# EAGLE design arduino board rev 1.4 (EAGLE 9.4.2)
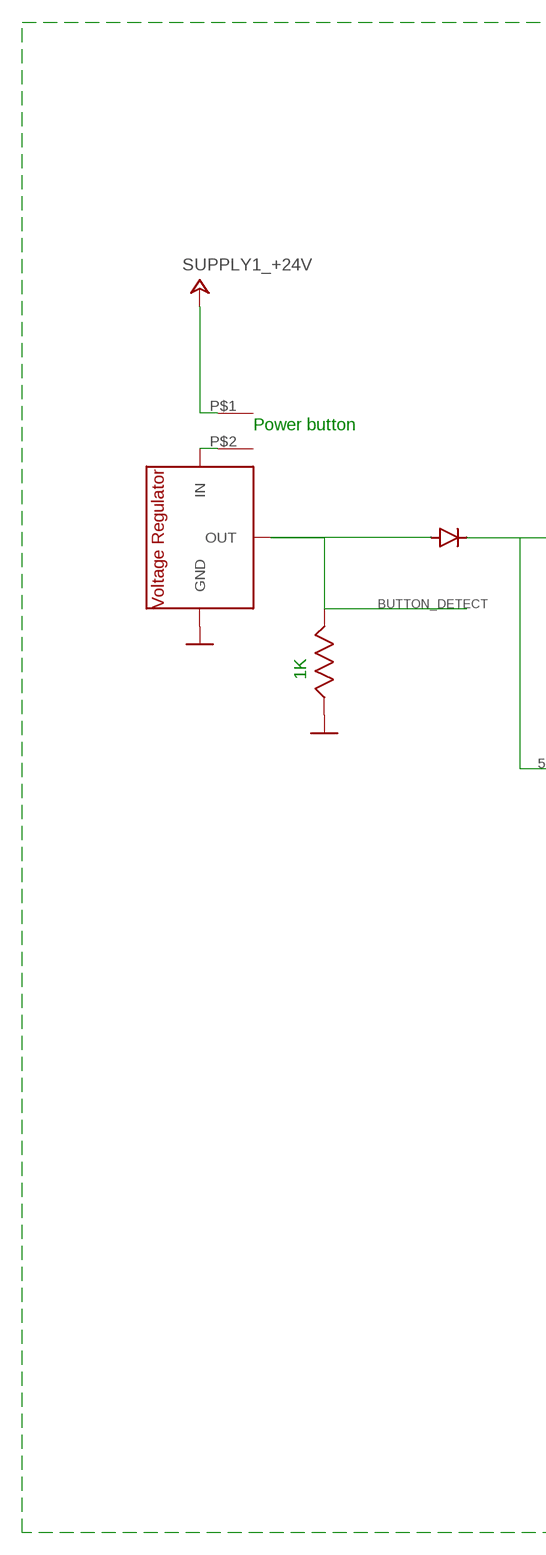
[diagram p0: schematic, sheet 1, part 1 of 2]
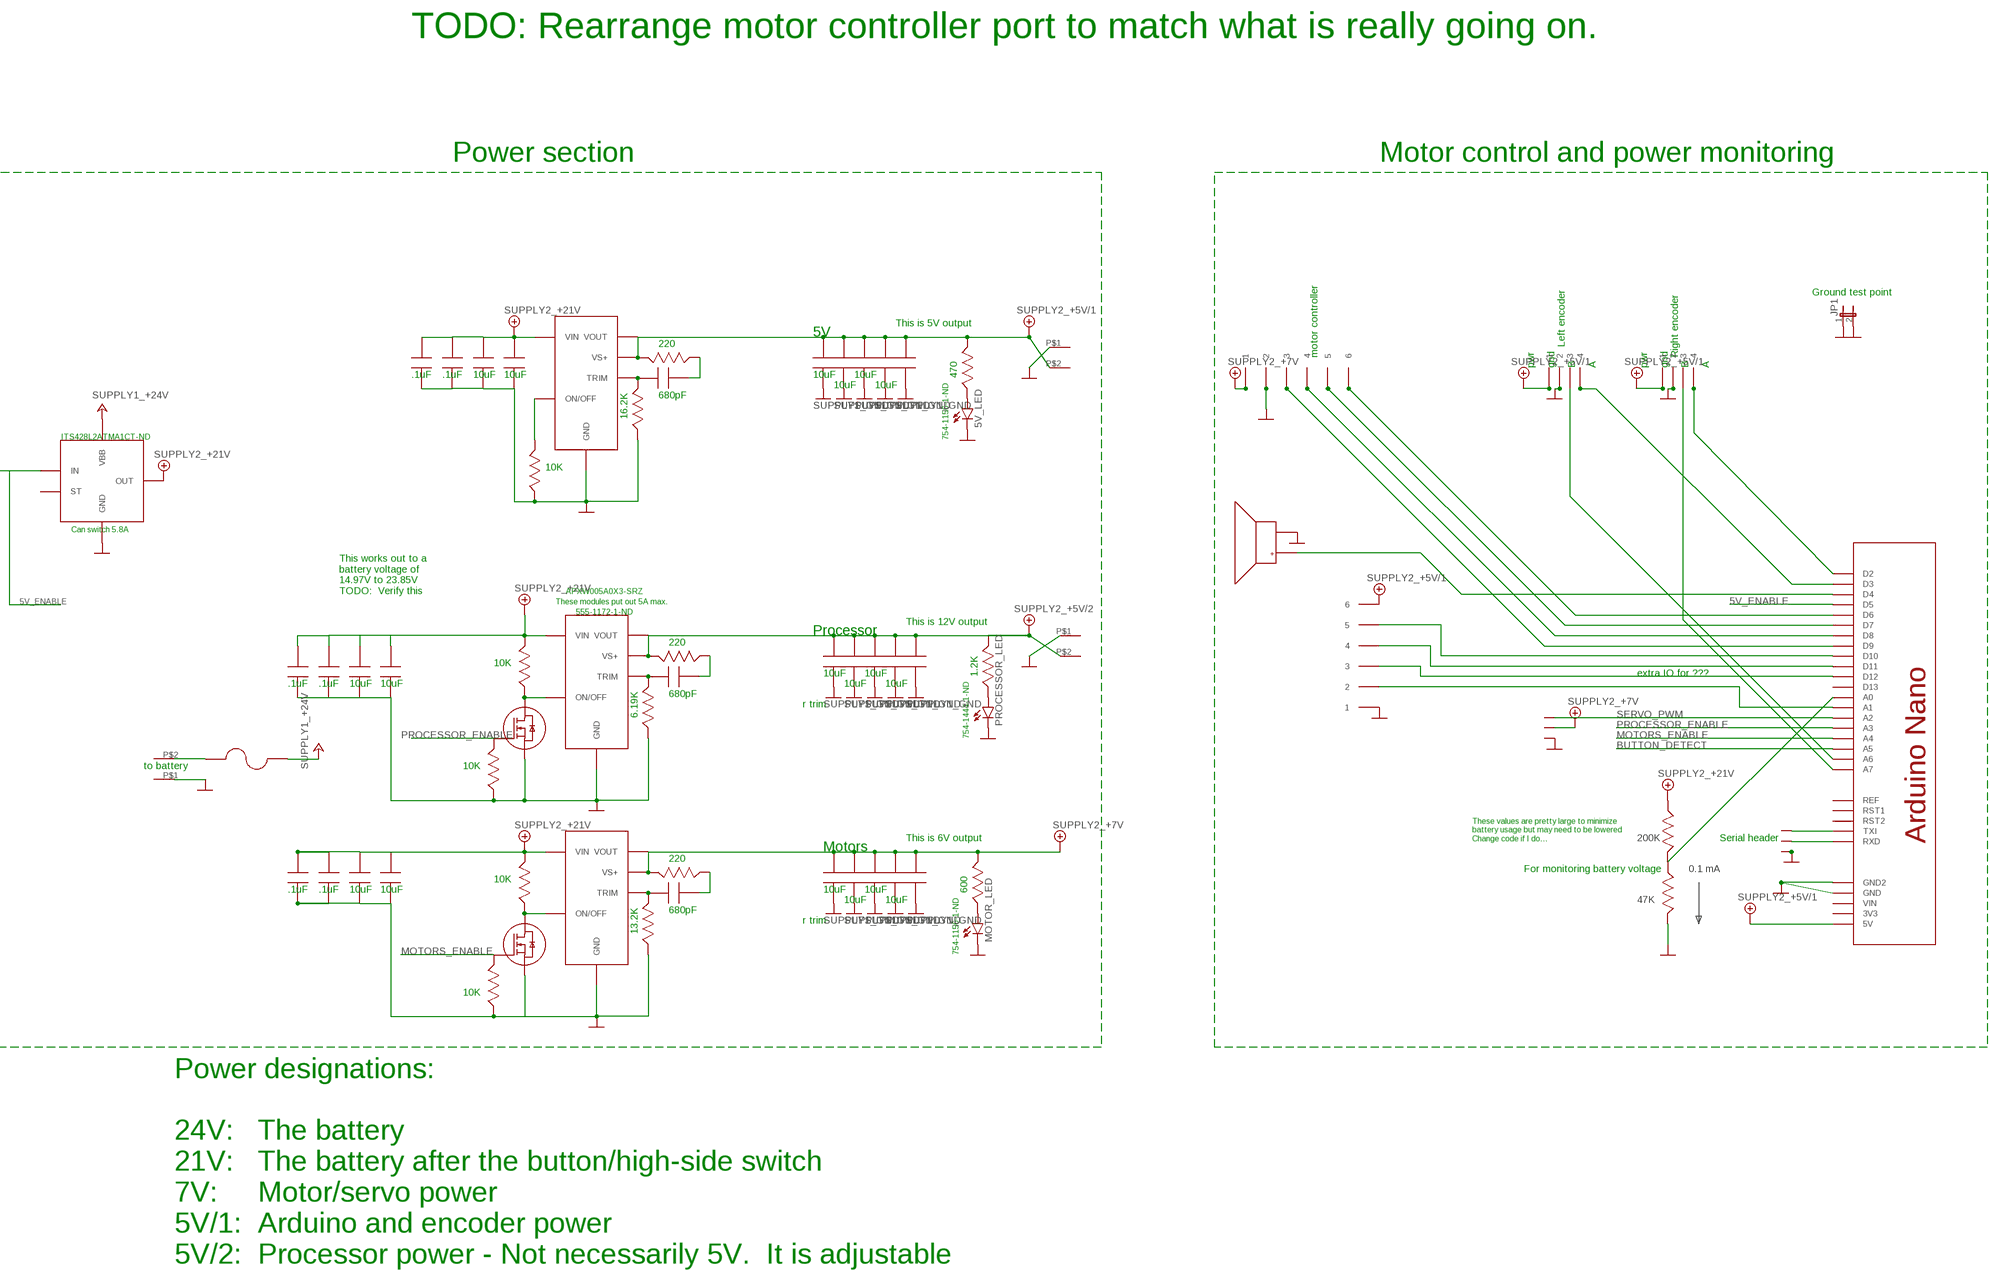
[diagram p1: schematic, sheet 1, part 2 of 2]

## Parts
5V_C_680PF  JACK_CAPACITOR0805  [JACK_0805]
5V_IN_CAP_1  JACK_CAPACITOR  [JACK_1210]
5V_IN_CAP_2  JACK_CAPACITOR  [JACK_1210]
5V_IN_CAP_3  JACK_CAPACITOR  [JACK_1210]
5V_IN_CAP_4  JACK_CAPACITOR  [JACK_1210]
5V_LED  LED_LEDSML1206  [LED_SML1206]
5V_LED_R1  JACK_RESISTOR0805  [JACK_0805]
5V_OUT_CAP_1  JACK_CAPACITOR  [JACK_1210]
5V_OUT_CAP_2  JACK_CAPACITOR  [JACK_1210]
5V_OUT_CAP_3  JACK_CAPACITOR  [JACK_1210]
5V_OUT_CAP_4  JACK_CAPACITOR  [JACK_1210]
5V_OUT_CAP_5  JACK_CAPACITOR  [JACK_1210]
5V_R_220  JACK_RESISTOR0805  [JACK_0805]
5V_REGULATOR_PULLDOWN  JACK_RESISTOR0805  [JACK_0805]
BATTERY_VOLTAGE_DIVIDER_HIGH  JACK_RESISTOR0805  [JACK_0805]
BATTERY_VOLTAGE_DIVIDER_LOW  JACK_RESISTOR0805  [JACK_0805]
BEEPER  JACK_BEEPER  [JACK_BEEPER_433-1033-ND]
DC2DC_PROCESSOR_  JACK_DC_TO_DC_VARIABLE_555-1172-1-ND  [JACK_DC2DC_555-1172-1-ND]
HIGH-SIDE_BLOCKING_DIODE  JACK_DIODESOD-23/SC-76  [JACK_SOD-323/SC-76]
HIGH-SIDE_SWITCH  JACK_HIGH-SIDE_SWITCH_INFINEON_ITS428L2  [JACK_INFINEON_TO-252-5-11]
HIGH-SIDE_SWITCH_BUTTON_DIVIDER_LOW  JACK_RESISTOR0805  [JACK_0805]
JP1  JUMPER_JP1E  [JUMPER_JP1]
MOTOR.1UF  JACK_CAPACITOR  [JACK_1210]
MOTOR_C_680PF  JACK_CAPACITOR0805  [JACK_0805]
MOTOR_ENABLE_MOSFET  JACK_MOSFET_N_CHANNELBSS138LCT-ND  [JACK_SOT23]
MOTOR_IN10UF  JACK_CAPACITOR  [JACK_1210]
MOTOR_IN.1UF  JACK_CAPACITOR  [JACK_1210]
MOTOR_IN.1UF1  JACK_CAPACITOR  [JACK_1210]
MOTOR_IN.1UF4  JACK_CAPACITOR  [JACK_1210]
MOTOR_LED  LED_LEDSML1206  [LED_SML1206]
MOTOR_LED_R  JACK_RESISTOR0805  [JACK_0805]
MOTOR_MOSFET_PULLDOWN  JACK_RESISTOR0805  [JACK_0805]
MOTOR_PULLUP  JACK_RESISTOR0805  [JACK_0805]
MOTOR_R_220  JACK_RESISTOR0805  [JACK_0805]
MOTOR_TRIM  JACK_RESISTOR0805  [JACK_0805]
MOTOTR10UF  JACK_CAPACITOR  [JACK_1210]
MOTOTR10UF1  JACK_CAPACITOR  [JACK_1210]
MOTOTR10UF2  JACK_CAPACITOR  [JACK_1210]
MOTOTR10UF3  JACK_CAPACITOR  [JACK_1210]
PROC10UF  JACK_CAPACITOR  [JACK_1210]
PROC10UF1  JACK_CAPACITOR  [JACK_1210]
PROC10UF2  JACK_CAPACITOR  [JACK_1210]
PROC10UF3  JACK_CAPACITOR  [JACK_1210]
PROC.1UF  JACK_CAPACITOR  [JACK_1210]
PROC_IN10UF  JACK_CAPACITOR  [JACK_1210]
PROC_IN_.1UF  JACK_CAPACITOR  [JACK_1210]
PROC_IN_.1UF1  JACK_CAPACITOR  [JACK_1210]
PROC_IN_.1UF2  JACK_CAPACITOR  [JACK_1210]
PROCESSOR_C_680PF  JACK_CAPACITOR0805  [JACK_0805]
PROCESSOR_ENABLE_MOSFET  JACK_MOSFET_N_CHANNELBSS138LCT-ND  [JACK_SOT23]
PROCESSOR_LED  LED_LEDSML1206  [LED_SML1206]
PROCESSOR_LED_R  JACK_RESISTOR0805  [JACK_0805]
PROCESSOR_MOSFET_PULLDOWN  JACK_RESISTOR0805  [JACK_0805]
PROCESSOR_PULLUP  JACK_RESISTOR0805  [JACK_0805]
PROCESSOR_R_220  JACK_RESISTOR0805  [JACK_0805]
RTRIM_5V  JACK_RESISTOR0805  [JACK_0805]
RTRIM_PROCESSOR  JACK_RESISTOR0805  [JACK_0805]
SERVO_HEADER  JACK_CONNECTOR_3_PIN  [JACK_THREE_.1"_HOLES]
U$1  JACK_SCREW_TERMINAL_2_CONDUCTORAMP-282837-2  [JACK_AMP-282837-2]
U$2  JACK_SCREW_TERMINAL_2_CONDUCTORAMP-282837-2  [JACK_AMP-282837-2]
U$3  JACK_CONNECTOR_6_PINJST_MAYBE  [JACK_JST_6_PIN_.1"]
U$4  JACK_DC_TO_DC_VARIABLE_555-1172-1-ND  [JACK_DC2DC_555-1172-1-ND]
U$5  JACK_SCREW_TERMINAL_2_CONDUCTORAMP-282837-2  [JACK_AMP-282837-2]
U$6  JACK_SCREW_TERMINAL_2_CONDUCTORAMP-282837-2  [JACK_AMP-282837-2]
U$7  VOLTAGE_REGULATOR  [JACK_SOT23]
U$9  JACK_CONNECTOR_6_PINJST_MAYBE  [JACK_JST_6_PIN_.1"]
U$10  JACK_CONNECTOR_4_PIN  [JACK_JST_4_PIN_.1"]
U$11  JACK_FUSE_HOLDER_F065-ND  [JACK_FUSE_HOLDER_F064-ND]
U$12  JACK_CONNECTOR_4_PIN  [JACK_JST_4_PIN_.1"]
U$13  JACK_CONNECTOR_3_PINMAYBE_JST  [JACK_JST_3_PIN_.1"]
U$14  JACK_ARDUINO_NANO  [JACK_ARDUINO_NANO]
U$17  JACK_DC_TO_DC_VARIABLE_555-1172-1-ND  [JACK_DC2DC_555-1172-1-ND]

## Nets
5V_ENABLE: HIGH-SIDE_BLOCKING_DIODE.C HIGH-SIDE_SWITCH.2(IN) U$14.P$8(D5)
+5V/1: 5V_LED_R1.P$3 5V_OUT_CAP_1.2 5V_OUT_CAP_2.2 5V_OUT_CAP_3.2 5V_OUT_CAP_4.2 5V_OUT_CAP_5.2 5V_R_220.P$3 U$2.P$2 U$3.6 U$4.VOUT U$4.VS+ U$10.1 U$12.1 U$14.P$19(5V) ; supply symbol labelled SUPPLY2_+5V/1
+5V/2: DC2DC_PROCESSOR_.VOUT DC2DC_PROCESSOR_.VS+ PROC10UF1.2 PROC10UF2.2 PROC10UF3.2 PROC10UF.2 PROC.1UF.2 PROCESSOR_LED_R.P$3 PROCESSOR_R_220.P$3 U$5.P$2 ; supply symbol labelled SUPPLY2_+5V/2
+7V: MOTOR.1UF.2 MOTOR_LED_R.P$3 MOTOR_R_220.P$3 MOTOTR10UF1.2 MOTOTR10UF2.2 MOTOTR10UF3.2 MOTOTR10UF.2 SERVO_HEADER.2 U$9.1 U$17.VOUT U$17.VS+ ; supply symbol labelled SUPPLY2_+7V
+21V: 5V_IN_CAP_1.2 5V_IN_CAP_2.2 5V_IN_CAP_3.2 5V_IN_CAP_4.2 BATTERY_VOLTAGE_DIVIDER_HIGH.P$2 DC2DC_PROCESSOR_.VIN HIGH-SIDE_SWITCH.5(OUT) MOTOR_IN10UF.2 MOTOR_IN.1UF1.2 MOTOR_IN.1UF4.2 MOTOR_IN.1UF.2 MOTOR_PULLUP.P$3 PROC_IN10UF.2 PROC_IN_.1UF1.2 PROC_IN_.1UF2.2 PROC_IN_.1UF.2 PROCESSOR_PULLUP.P$3 U$4.VIN U$17.VIN ; supply symbol labelled SUPPLY2_+21V
+24V: HIGH-SIDE_SWITCH.TAB(VBB) U$1.P$1 U$11.P$1 ; supply symbol labelled SUPPLY1_+24V
BUTTON_DETECT: HIGH-SIDE_BLOCKING_DIODE.A HIGH-SIDE_SWITCH_BUTTON_DIVIDER_LOW.P$3 U$7.1(OUT) U$14.P$22(A5)
GND: 5V_IN_CAP_1.1 5V_IN_CAP_2.1 5V_IN_CAP_3.1 5V_IN_CAP_4.1 5V_LED.C 5V_OUT_CAP_1.1 5V_OUT_CAP_2.1 5V_OUT_CAP_3.1 5V_OUT_CAP_4.1 5V_OUT_CAP_5.1 5V_REGULATOR_PULLDOWN.P$2 BATTERY_VOLTAGE_DIVIDER_LOW.P$3 BEEPER.- DC2DC_PROCESSOR_.GND HIGH-SIDE_SWITCH.1(GND) HIGH-SIDE_SWITCH_BUTTON_DIVIDER_LOW.P$2 JP1.1 JP1.2 MOTOR.1UF.1 MOTOR_ENABLE_MOSFET.2(S) MOTOR_IN10UF.1 MOTOR_IN.1UF1.1 MOTOR_IN.1UF4.1 MOTOR_IN.1UF.1 MOTOR_LED.C MOTOR_MOSFET_PULLDOWN.P$2 MOTOR_TRIM.P$2 MOTOTR10UF1.1 MOTOTR10UF2.1 MOTOTR10UF3.1 MOTOTR10UF.1 PROC10UF1.1 PROC10UF2.1 PROC10UF3.1 PROC10UF.1 PROC.1UF.1 PROC_IN10UF.1 PROC_IN_.1UF1.1 PROC_IN_.1UF2.1 PROC_IN_.1UF.1 PROCESSOR_ENABLE_MOSFET.2(S) PROCESSOR_LED.C PROCESSOR_MOSFET_PULLDOWN.P$2 RTRIM_5V.P$2 RTRIM_PROCESSOR.P$2 SERVO_HEADER.1 U$2.P$1 U$3.1 U$4.GND U$5.P$1 U$6.P$1 U$7.3(GND) U$9.2 U$10.2 U$12.2 U$13.1 U$14.P$12(GND) U$14.P$17(GND2) U$17.GND ; supply symbol labelled SUPPLY1_GND
IN: U$1.P$2 U$7.2(IN)
MOTORS_ENABLE: MOTOR_ENABLE_MOSFET.1(G) MOTOR_MOSFET_PULLDOWN.P$3 U$14.P$23(A4)
N$4: PROCESSOR_LED.A PROCESSOR_LED_R.P$2
N$5: MOTOR_LED.A MOTOR_LED_R.P$2
N$6: DC2DC_PROCESSOR_.ON/OFF PROCESSOR_ENABLE_MOSFET.3(D) PROCESSOR_PULLUP.P$2
N$7: U$12.3 U$14.P$20(A7)
N$8: U$3.5 U$14.P$3(D10)
N$9: MOTOR_ENABLE_MOSFET.3(D) MOTOR_PULLUP.P$2 U$17.ON/OFF
N$10: U$9.6 U$14.P$7(D6)
N$11: U$12.4 U$14.P$11(D2)
N$12: U$6.P$2 U$11.P$2
N$13: U$13.3 U$14.P$15(TXI)
N$14: U$13.2 U$14.P$14(RXD)
N$15: U$10.4 U$14.P$10(D3)
N$16: U$10.3 U$14.P$21(A6)
N$17: BEEPER.+ U$14.P$9(D4)
N$18: U$9.5 U$14.P$6(D7)
N$19: U$9.4 U$14.P$5(D8)
N$20: U$9.3 U$14.P$4(D9)
N$21: 5V_C_680PF.P$3 RTRIM_5V.P$3 U$4.TRIM
N$27: U$3.2 U$14.P$26(A1)
N$28: U$3.4 U$14.P$2(D11)
N$29: 5V_LED.A 5V_LED_R1.P$2
N$30: BATTERY_VOLTAGE_DIVIDER_HIGH.P$3 BATTERY_VOLTAGE_DIVIDER_LOW.P$2 U$14.P$27(A0)
N$31: U$3.3 U$14.P$1(D12)
N$32: 5V_REGULATOR_PULLDOWN.P$3 U$4.ON/OFF
N$33: 5V_C_680PF.P$2 5V_R_220.P$2
N$34: DC2DC_PROCESSOR_.TRIM PROCESSOR_C_680PF.P$3 RTRIM_PROCESSOR.P$3
N$35: MOTOR_C_680PF.P$3 MOTOR_TRIM.P$3 U$17.TRIM
N$36: PROCESSOR_C_680PF.P$2 PROCESSOR_R_220.P$2
N$37: MOTOR_C_680PF.P$2 MOTOR_R_220.P$2
PROCESSOR_ENABLE: PROCESSOR_ENABLE_MOSFET.1(G) PROCESSOR_MOSFET_PULLDOWN.P$3 U$14.P$24(A3)
SERVO_PWM: SERVO_HEADER.3 U$14.P$25(A2)
Unconnected: HIGH-SIDE_SWITCH.4(ST) U$14.P$13(RST1) U$14.P$16(VIN) U$14.P$18(RST2) U$14.P$28(REF) U$14.P$29(3V3) U$14.P$30(D13)

## Notes on the sheet
- TODO: Rearrange motor controller port to match what is really going on.
- Power section | Motor control and power monitoring
- Ground test point
- This is 5V output
- 5V
- 220 | Left encoder
- motor controller | Right encoder
- pwr | gnd | B | A | pwr | gnd | B | A
- .1uF | .1uF | 10uF | 10uF | 10uF | 10uF | 470
- 10uF | 10uF
- 680pF
- Power button
- 16.2K
- ITS428L2ATMA1CT-ND | 754-1156-1-ND
- 10K
- Can switch 5.8A
- 1K
- This works out to a
  battery voltage of
  14.97V to 23.85V
  TODO:  Verify this
- APXW005A0X3-SRZ
- These modules put out 5A max.
- 555-1172-1-ND
- This is 12V output
- Processor
- 220
- 10K
- 10uF | 10uF | 1.2K | extra IO for ???
- .1uF | .1uF | 10uF | 10uF | 10uF | 10uF
- 680pF
- r trim
- 6.19K
- 754-1444-1-ND
- to battery | 10K
- This is 6V output
- These values are pretty large to minimize
  battery usage but may need to be lowered 
  Change code if I do...
- 200K | Serial header
- Motors
- 220
- For monitoring battery voltage | 0.1 mA
- 10K
- .1uF | .1uF | 10uF | 10uF | 10uF | 10uF | 600
- 10uF | 10uF | 47K
- 680pF
- r trim
- 13.2K
- 754-1156-1-ND
- 10K
- Power designations:
  
  24V:   The battery
  21V:   The battery after the button/high-side switch
  7V:     Motor/servo power
  5V/1:  Arduino and encoder power
  5V/2:  Processor power - Not necessarily 5V.  It is adjustable

## Library data of the parts
5V_C_680PF 5V_IN_CAP_1-5V_IN_CAP_4 5V_OUT_CAP_1-5V_OUT_CAP_5 MOTOR.1UF MOTOR_C_680PF MOTOR_IN10UF MOTOR_IN.1UF MOTOR_IN.1UF1 MOTOR_IN.1UF4 MOTOTR10UF MOTOTR10UF1-MOTOTR10UF3 PROC10UF PROC10UF1-PROC10UF3 PROC.1UF PROC_IN10UF PROC_IN_.1UF PROC_IN_.1UF1 PROC_IN_.1UF2 PROCESSOR_C_680PF = arduino board rev 1.3:JACK_CAPACITOR
5V_LED MOTOR_LED PROCESSOR_LED = arduino board rev 1.3:LED_LED: LED OSRAM: - CHIPLED LG R971, LG N971, LY N971, LG Q971, LY Q971, LO R971, LY R971 LH N974, LH R974 LS Q976, LO Q976, LY Q976 LO Q996 - Hyper CHIPLED LW Q18S LB Q993, LB Q99A, LB R99A - SideLED LS A670, LO A670, LY A670, LG A670, LP A670 LB A673, LV A673, LT A673, LW A673 LH A674 LY A675 LS A676, LA A676, LO A676, LY A676, LW A676 LS A679, LY A679, LG A679 - Hyper Micro SIDELED® LS Y876, LA Y876, LO Y876, LY Y876 LT Y87S - SmartLED LW L88C, LW L88S LB L89C, LB L89S, LG L890 LS L89K, LO L89K, LY L89K LS L896, LA L896, LO L896, LY L896 - TOPLED LS T670, LO T670, LY T670, LG T670, LP T670 LSG T670, LSP T670, LSY T670, LOP T670, LYG T670 LG T671, LOG T671, LSG T671 LB T673, LV T673, LT T673, LW T673 LH T674 LS T676, LA T676, LO T676, LY T676, LB T676, LH T676, LSB T676, LW T676 LB T67C, LV T67C, LT T67C, LS T67K, LO T67K, LY T67K, LW E67C LS E67B, LA E67B, LO E67B, LY E67B, LB E67C, LV E67C, LT E67C LW T67C LS T679, LY T679, LG T679 LS T770, LO T770, LY T770, LG T770, LP T770 LB T773, LV T773, LT T773, LW T773 LH T774 LS E675, LA E675, LY E675, LS T675 LS T776, LA T776, LO T776, LY T776, LB T776 LHGB T686 LT T68C, LB T68C - Hyper Mini TOPLED® LB M676 - Mini TOPLED Santana® LG M470 LS M47K, LO M47K, LY M47K Source: http://www.osram.convergy.de LUXEON: - LUMILED® LXK2-PW12-R00, LXK2-PW12-S00, LXK2-PW14-U00, LXK2-PW14-V00 LXK2-PM12-R00, LXK2-PM12-S00, LXK2-PM14-U00 LXK2-PE12-Q00, LXK2-PE12-R00, LXK2-PE12-S00, LXK2-PE14-T00, LXK2-PE14-U00 LXK2-PB12-K00, LXK2-PB12-L00, LXK2-PB12-M00, LXK2-PB14-N00, LXK2-PB14-P00, LXK2-PB14-Q00 LXK2-PR12-L00, LXK2-PR12-M00, LXK2-PR14-Q00, LXK2-PR14-R00 LXK2-PD12-Q00, LXK2-PD12-R00, LXK2-PD12-S00 LXK2-PH12-R00, LXK2-PH12-S00 LXK2-PL12-P00, LXK2-PL12-Q00, LXK2-PL12-R00 Source: www.luxeon.com KINGBRIGHT: KA-3528ASYC Source: www.kingbright.com
5V_LED_R1 5V_R_220 5V_REGULATOR_PULLDOWN BATTERY_VOLTAGE_DIVIDER_HIGH BATTERY_VOLTAGE_DIVIDER_LOW HIGH-SIDE_SWITCH_BUTTON_DIVIDER_LOW MOTOR_LED_R MOTOR_MOSFET_PULLDOWN MOTOR_PULLUP MOTOR_R_220 MOTOR_TRIM PROCESSOR_LED_R PROCESSOR_MOSFET_PULLDOWN PROCESSOR_PULLUP PROCESSOR_R_220 RTRIM_5V RTRIM_PROCESSOR = arduino board rev 1.3:JACK_RESISTOR
BEEPER = arduino board rev 1.3:JACK_BEEPER
DC2DC_PROCESSOR_ U$4 U$17 = arduino board rev 1.3:JACK_DC_TO_DC_VARIABLE_555-1172-1-ND
HIGH-SIDE_BLOCKING_DIODE = arduino board rev 1.3:JACK_DIODE
HIGH-SIDE_SWITCH = arduino board rev 1.3:JACK_HIGH-SIDE_SWITCH_INFINEON_ITS428L2
JP1 = arduino board rev 1.3:JUMPER_JP1E: JUMPER
MOTOR_ENABLE_MOSFET PROCESSOR_ENABLE_MOSFET = arduino board rev 1.3:JACK_MOSFET_N_CHANNEL
SERVO_HEADER U$13 = arduino board rev 1.3:JACK_CONNECTOR_3_PIN
U$1 U$2 U$5 U$6 = arduino board rev 1.3:JACK_SCREW_TERMINAL_2_CONDUCTOR
U$3 U$9 = arduino board rev 1.3:JACK_CONNECTOR_6_PIN
U$7 = arduino board rev 1.3:VOLTAGE_REGULATOR
U$10 U$12 = arduino board rev 1.3:JACK_CONNECTOR_4_PIN
U$11 = arduino board rev 1.3:JACK_FUSE_HOLDER_F065-ND
U$14 = arduino board rev 1.3:JACK_ARDUINO_NANO

## Net classes
0 default: clearance 0.254 mm

## Board
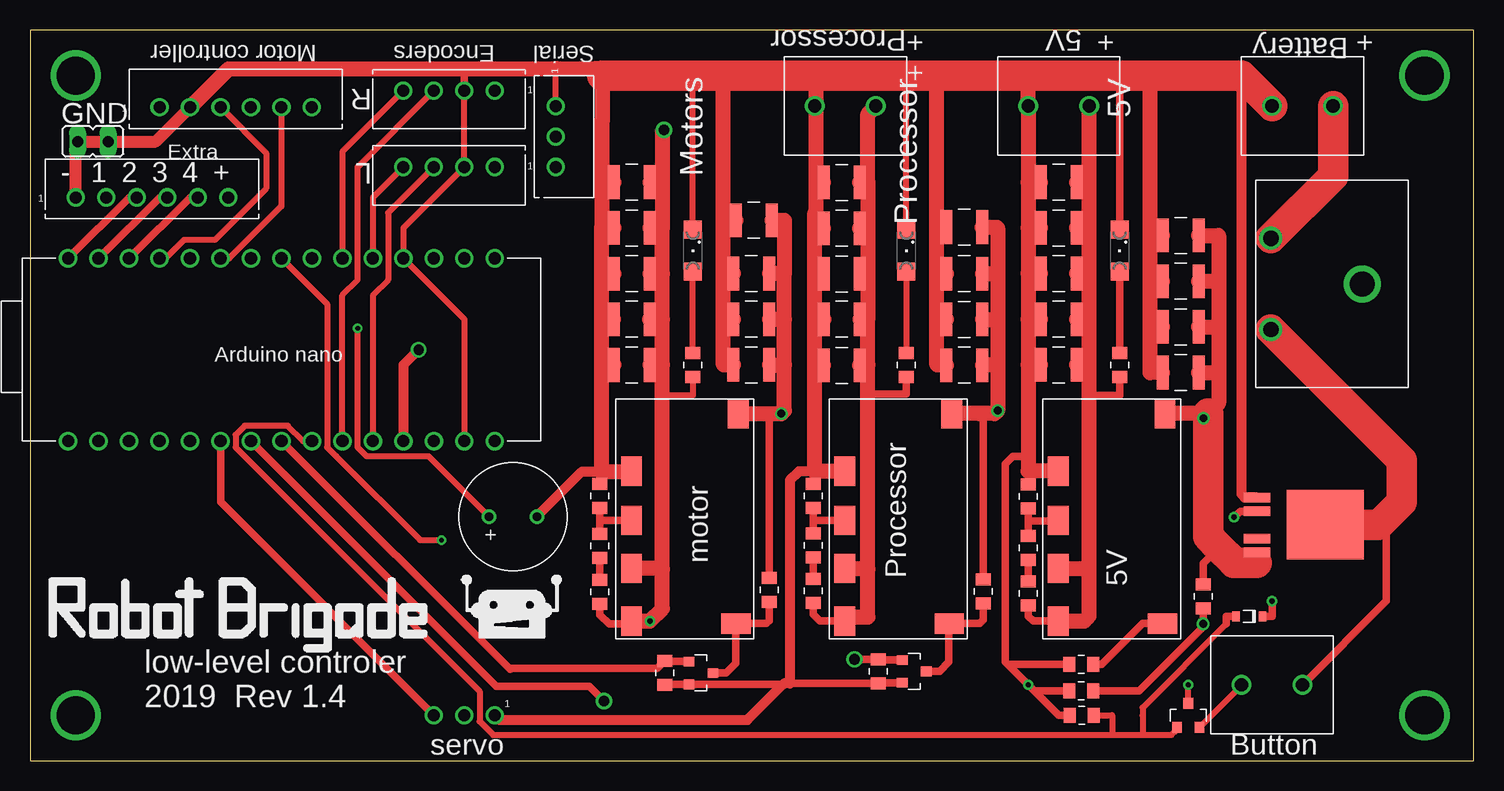
[diagram p2: board, top side]
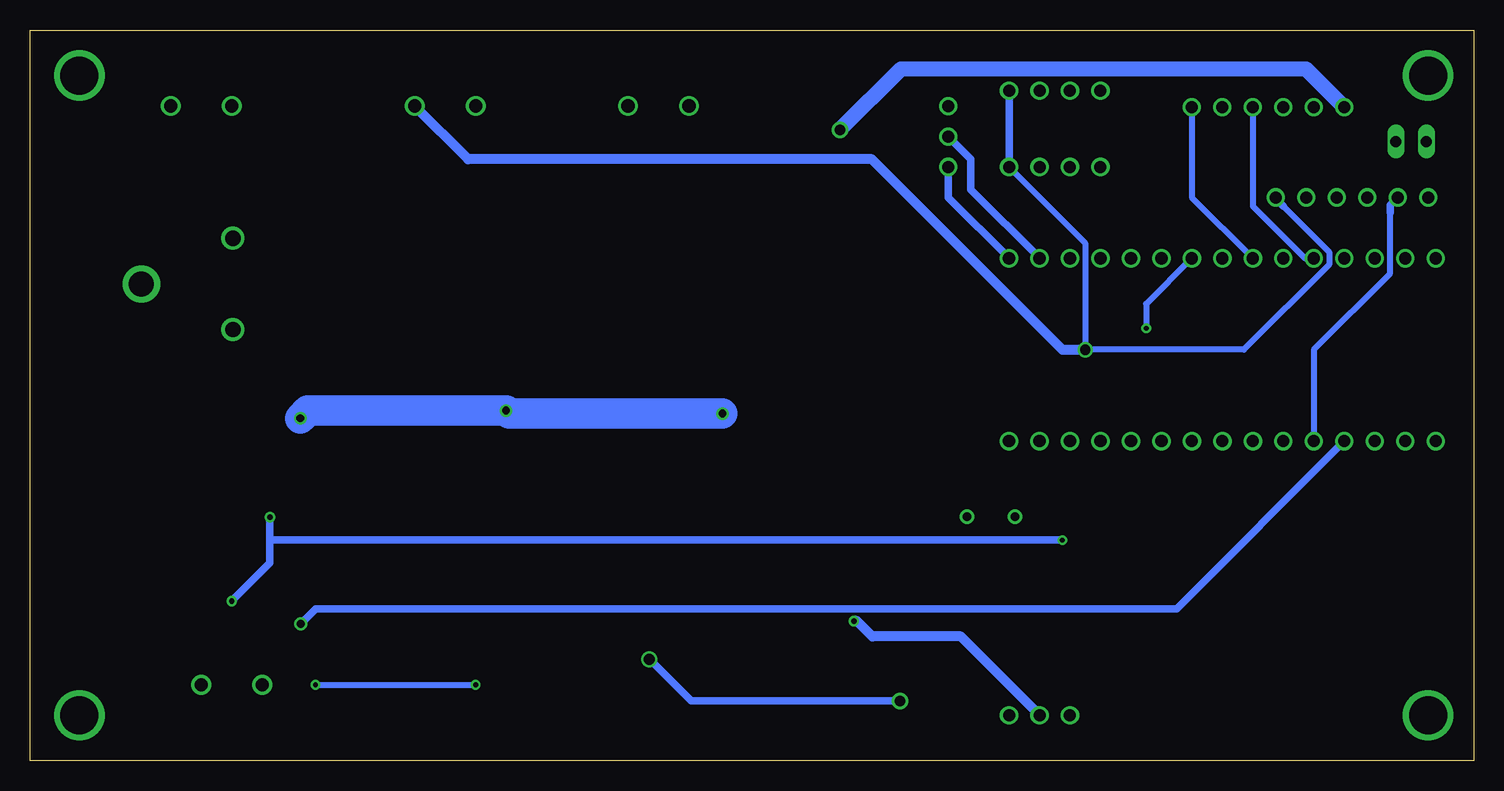
[diagram p3: board, bottom side, seen from below]

Size 120.32 x 60.95 mm. Coordinates in mm from the lower left corner, seen from the top.
Outline: 0,0 120.32,0 120.32,60.95 0,60.95 0,0
Copper layers (1*16): Top 0.035mm / dielectric 1.5mm / Bottom 0.035mm
Design rules "default *": minimum track width 6mil, minimum drill 0.4mm, track to track 6mil, track to pad 6mil, pad to pad 6mil, via to via 6mil, smd to smd 6mil, copper to edge 40mil, drill to drill 6mil, minimum pad ring 10mil, minimum via ring 8mil, stop-mask expansion 4mil, vias tented up to drill 0mil, thermal gap 10mil

### Footprints (pad centres in the part's own frame; a part is rotated, then mirrored left to right if it is on the bottom)
JACK_0805 = smd 1 x 1.25: P$2 -1,0; P$3 1,0
JACK_1210 = smd 1 x 2.8: 1 -1.5,0; 2 1.5,0
LED_SML1206 = smd 1.5 x 1.5: A 1.75,0; C -1.75,0
JACK_BEEPER_433-1033-ND = drill 0.7: + 0,-2; - 0,2
JACK_DC2DC_555-1172-1-ND = smd 2.44 x 1.73: GND 14,10.2; TRIM 9.9,10.2; VIN 18.8,1.3; VOUT 5.9,10.2; VS+ 1.5,10.2 | smd 1.73 x 2.44: ON/OFF 1.3,1.5
JACK_SOD-323/SC-76 = smd 0.63 x 0.83: A -1.11,0; C 1.11,0
JACK_INFINEON_TO-252-5-11 = smd 0.8 x 2.2: 1 -2.28,-8.86; 2 -1.14,-8.86; 4 1.14,-8.86; 5 2.28,-8.86 | smd 5.8 x 6.4: TAB 0,-3.2
JUMPER_JP1 = drill 0.914 long: 1 0,-1.27; 2 0,1.27
JACK_SOT23 = smd 0.8 x 0.9: 1 -0.95,-1; 2 0.95,-1; 3 0,1
JACK_THREE_.1"_HOLES = drill 1: 1 -2.54,0; 2 0,0; 3 2.54,0
JACK_AMP-282837-2 = drill 1.1: P$1 -2.54,0; P$2 2.54,0
JACK_JST_6_PIN_.1" = drill 1: 1 -6.35,0; 2 -3.81,0; 3 -1.27,0; 4 1.27,0; 5 3.81,0; 6 6.35,0
JACK_JST_4_PIN_.1" = drill 1: 1 -3.81,0; 2 -1.27,0; 3 1.27,0; 4 3.81,0
JACK_FUSE_HOLDER_F064-ND = drill 2.083: NC 0,-7.62 | drill 1.27: P$1 -3.81,0; P$2 3.81,0
JACK_JST_3_PIN_.1" = drill 1: 1 -2.54,0; 2 0,0; 3 2.54,0
JACK_ARDUINO_NANO = drill 1.016: P$1 0,0; P$2 2.54,0; P$3 5.08,0; P$4 7.62,0; P$5 10.16,0; P$6 12.7,0; P$7 15.24,0; P$8 17.78,0; P$9 20.32,0; P$10 22.86,0; P$11 25.4,0; P$12 27.94,0; P$13 30.48,0; P$14 33.02,0; P$15 35.56,0; P$16 35.56,-15.24; P$17 33.02,-15.24; P$18 30.48,-15.24; P$19 27.94,-15.24; P$20 25.4,-15.24; P$21 22.86,-15.24; P$22 20.32,-15.24; P$23 17.78,-15.24; P$24 15.24,-15.24; P$25 12.7,-15.24; P$26 10.16,-15.24; P$27 7.62,-15.24; P$28 5.08,-15.24; P$29 2.54,-15.24; P$30 0,-15.24

### Placement (x,y rotation side)
5V_C_680PF  83.19,17.78 90 top
5V_IN_CAP_1  95.89,43.81 0 top
5V_IN_CAP_2  95.89,40.01 0 top
5V_IN_CAP_3  95.89,36.2 0 top
5V_IN_CAP_4  95.89,32.38 0 top
5V_LED  90.81,42.55 270 top
5V_LED_R1  90.81,33.02 270 top
5V_OUT_CAP_1  85.72,48.26 0 top
5V_OUT_CAP_2  85.72,44.45 0 top
5V_OUT_CAP_3  85.72,40.64 0 top
5V_OUT_CAP_4  85.72,36.83 0 top
5V_OUT_CAP_5  85.72,33.02 0 top
5V_R_220  83.19,13.97 270 top
5V_REGULATOR_PULLDOWN  87.61,8.04 0 top
BATTERY_VOLTAGE_DIVIDER_HIGH  97.76,13.74 270 top
BATTERY_VOLTAGE_DIVIDER_LOW  87.62,5.85 180 top
BEEPER  40.24,20.38 270 top
DC2DC_PROCESSOR_  78.11,10.16 90 top
HIGH-SIDE_BLOCKING_DIODE  101.6,12.06 0 top
HIGH-SIDE_SWITCH  111.12,19.68 270 top
HIGH-SIDE_SWITCH_BUTTON_DIVIDER_LOW  87.63,3.81 0 top
JP1  5.23,51.64 270 top
MOTOR.1UF  50.15,33.02 0 top
MOTOR_C_680PF  47.5,17.92 90 top
MOTOR_ENABLE_MOSFET  55.91,7.34 270 top
MOTOR_IN10UF  77.86,36.82 0 top
MOTOR_IN.1UF  77.86,40.62 0 top
MOTOR_IN.1UF1  77.86,33 0 top
MOTOR_IN.1UF4  60.33,45.09 0 top
MOTOR_LED  55.24,42.55 270 top
MOTOR_LED_R  55.24,33.02 270 top
MOTOR_MOSFET_PULLDOWN  52.91,7.34 90 top
MOTOR_PULLUP  61.62,14.26 90 top
MOTOR_R_220  47.5,14.11 270 top
MOTOR_TRIM  47.5,22.1 270 top
MOTOTR10UF  50.15,44.44 0 top
MOTOTR10UF1  50.15,40.63 0 top
MOTOTR10UF2  50.14,36.83 0 top
MOTOTR10UF3  50.16,48.26 0 top
PROC10UF  67.63,44.42 0 top
PROC10UF1  67.65,36.83 0 top
PROC10UF2  67.66,40.61 0 top
PROC10UF3  67.63,48.23 0 top
PROC.1UF  67.63,32.99 0 top
PROC_IN10UF  60.11,33.02 0 top
PROC_IN_.1UF  60.11,36.83 0 top
PROC_IN_.1UF1  60.11,40.64 0 top
PROC_IN_.1UF2  77.84,44.51 0 top
PROCESSOR_C_680PF  65.25,17.98 90 top
PROCESSOR_ENABLE_MOSFET  73.69,7.47 270 top
PROCESSOR_LED  73.03,42.55 270 top
PROCESSOR_LED_R  73.03,33.02 270 top
PROCESSOR_MOSFET_PULLDOWN  70.69,7.47 90 top
PROCESSOR_PULLUP  79.43,14.13 90 top
PROCESSOR_R_220  65.25,14.17 270 top
RTRIM_5V  83.19,22.06 270 top
RTRIM_PROCESSOR  65.28,22.1 270 top
SERVO_HEADER  36.2,3.81 180 top
U$1  103.5,6.35 180 top
U$2  85.72,54.61 0 top
U$3  10.16,46.99 0 top
U$4  95.89,10.16 90 top
U$5  67.94,54.61 0 top
U$6  106.05,54.61 0 top
U$7  96.52,3.81 0 top
U$8  [ROBOT_BRIGADE_LOGO_AND_TEXT_.2"]  0.64,8.89 0 top
U$9  17.14,54.51 0 top
U$10  34.92,55.88 180 top
U$11  103.41,39.77 90 top
U$12  34.92,49.53 180 top
U$13  43.81,52.07 270 top
U$14  3.17,41.91 0 top
U$17  60.33,10.16 90 top

### Tracks (layer width: path | path; a pad name or v marks a point on that pad's centre or on a via)
5V_ENABLE  (via drill 0.4, 0.45)
  Top 0.508: U$14.P$8 24.77,38.1 24.77,26.14 25.51,25.4 25.53,25.4 32.51,18.41 v34.29,18.41
  Top 0.61: HIGH-SIDE_SWITCH.2 100.83,20.82 v100.33,20.32 | v103.5,13.34 103.5,12.06 HIGH-SIDE_BLOCKING_DIODE.C
  Bottom 0.61: v103.5,13.34 100.33,16.51 100.33,18.41 | 100.33,18.41 v100.33,20.32 | v34.29,18.41 100.33,18.41
+5V/1  (via drill 0.85)
  Top 0.61: 5V_LED_R1.P$3 90.81,30.48 88.27,30.48 | 5V_R_220.P$3 83.19,12.06 83.59,11.66 U$4.VS+
  Top 0.813: v32.38,34.29 31.11,33.02 U$14.P$19
  Top 1.27: U$4.VOUT 88.27,16.06 | 88.27,16.06 88.27,30.48 88.27,33.02 | 88.27,33.02 88.27,36.83 | 88.27,36.83 88.27,40.64 | 88.27,40.64 88.27,44.45 | 88.27,44.45 88.27,48.26 | 88.27,48.26 U$2.P$2 | 5V_OUT_CAP_1.2 88.27,48.26 | 5V_OUT_CAP_2.2 88.27,44.45 | 5V_OUT_CAP_3.2 88.27,40.64 | 5V_OUT_CAP_4.2 88.27,36.83 | 5V_OUT_CAP_5.2 88.27,33.02 | U$4.VS+ 87.86,11.66 88.27,12.06 88.27,16.06
  Bottom 0.508: U$12.1 32.38,43.18 v32.38,34.29 19.16,34.29 12.06,41.38 12.06,42.44 15.88,46.25
  Bottom 0.61: U$10.1 U$12.1 | 15.88,46.25 16.51,46.88 U$3.6
  Bottom 0.813: v32.38,34.29 34.29,34.29 50.16,50.16 83.82,50.16 U$2.P$2
+5V/2
  Top 0.61: PROCESSOR_LED_R.P$3 73.03,30.59 69.87,30.59 69.83,30.55 | 69.83,43.09 69.83,44.22 PROC10UF.2 69.83,44.62 | 69.83,32.42 69.83,33.02 69.83,43.09 | 69.83,43.09 PROC10UF2.2 | PROC10UF1.2 69.83,36.9 | PROCESSOR_R_220.P$3 65.25,12.22 65.81,11.66 DC2DC_PROCESSOR_.VS+
  Top 1.27: DC2DC_PROCESSOR_.VS+ 68.25,12 69.83,12 69.83,16 | 69.83,16 69.83,30.55 69.83,33.02 | 69.83,33.02 69.83,36.9 | 69.83,48.26 69.83,44.45 | 69.83,44.45 69.83,37 69.33,37 PROC10UF1.2 | DC2DC_PROCESSOR_.VOUT 69.77,16.06 69.83,16 | PROC10UF3.2 69.79,48.23 69.83,48.26 | PROC.1UF.2 69.79,32.99 69.83,33.02 | PROC10UF.2 69.79,44.42 69.83,44.45 | U$5.P$2 69.83,53.95 69.83,48.26
+7V  (via drill 0.45, 0.9)
  Top 0.508: MOTOR_LED_R.P$3 55.24,30.48 52.7,30.48
  Top 0.61: MOTOR_R_220.P$3 47.5,12.19 48.26,11.43 49.9,11.43 U$17.VS+
  Top 1.27: U$17.VS+ v51.66,11.66 52.7,12.7 52.7,16 | 52.7,16 52.65,16.06 U$17.VOUT | 52.7,16 52.7,30.48 52.7,33.02 | 52.7,33.02 52.7,36.83 | 52.7,36.83 52.7,40.63 | 52.7,40.63 52.7,44.44 | v52.83,52.62 52.7,52.5 52.7,48.26 | 52.7,48.26 52.7,44.44 | MOTOR.1UF.2 52.7,33.02 | MOTOTR10UF2.2 52.7,36.83 | 52.7,36.83 | MOTOTR10UF1.2 52.7,40.63 | MOTOTR10UF.2 52.7,44.44 | MOTOTR10UF3.2 52.7,48.26
  Bottom 0.813: SERVO_HEADER.2 42.76,10.37 50.13,10.37 51.42,11.66 v51.66,11.66
  Bottom 1.27: U$9.1 14,57.71 47.73,57.71 v52.83,52.62
+21V  (via drill 0.65)
  Top 0.61: PROCESSOR_PULLUP.P$3 79.43,28.65 79.12,28.96 | BATTERY_VOLTAGE_DIVIDER_HIGH.P$2 97.76,16.48 99.08,17.8 | MOTOR_PULLUP.P$3 61.59,15.28 61.59,28.96
  Top 0.813: HIGH-SIDE_SWITCH.5 102.23,17.38 102.23,16.51 | v97.79,28.57 98.42,28.57 98.81,28.96
  Top 1.27: U$4.VIN 98.81,28.96 98.17,28.32 | 99.06,40.01 99.06,36.2 | 99.06,36.2 99.06,32.38 | 99.06,32.38 99.06,29.84 98.17,28.96 | 5V_IN_CAP_4.2 99.06,32.38 | 5V_IN_CAP_3.2 99.06,36.2 | 5V_IN_CAP_2.2 99.06,40.01 | 5V_IN_CAP_1.2 99.06,43.81 99.06,40.01 | PROC_IN_.1UF2.2 80.59,44.51 80.64,44.45 80.64,40.64 | 80.64,40.64 80.64,36.83 | 80.64,36.83 80.64,33.02 | 80.64,33.02 80.63,33 MOTOR_IN.1UF1.2 | MOTOR_IN10UF.2 80.63,36.82 80.64,36.83 | MOTOR_IN.1UF.2 80.63,40.62 80.64,40.64 | 80.64,33.02 v80.64,29.21 80.39,28.96 79.12,28.96 DC2DC_PROCESSOR_.VIN | MOTOR_IN.1UF4.2 62.87,45.09 62.87,40.64 | 62.87,40.64 | 62.87,40.64 PROC_IN_.1UF1.2 | PROC_IN_.1UF.2 62.86,36.83 62.87,36.83 | 62.87,36.83 62.87,40.64 | 62.87,40.64 | PROC_IN10UF.2 62.86,33.02 62.87,33.02 | 62.87,33.02 62.87,36.83 | U$17.VIN 61.59,28.96 v62.62,28.96 62.87,29.21 62.87,33.02
  Top 2.54: 102.23,16.51 100.33,16.51 100.25,16.59 100.25,16.63 99.08,17.8 98.17,18.71 98.17,28.32 98.17,28.96
  Bottom 2.54: v62.62,28.96 80.39,28.96 v80.64,29.21 97.16,29.21 v97.79,28.57
+24V
  Top 0.61: 112.39,19.68 113.03,19.05 113.03,13.34 U$1.P$1
  Top 2.54: HIGH-SIDE_SWITCH.TAB 112.39,19.68 114.3,21.59 114.3,25.07 U$11.P$1
BUTTON_DETECT
  Top 0.508: U$14.P$22 22.75,26.67 21.48,27.94 17.89,27.94 17.14,27.2 17.14,26.14 37.47,5.82 37.47,3.29 38.6,2.16 90.17,2.16 | 90.17,2.16 92.71,2.16 | 92.71,2.16 95.12,2.16 95.5,2.54 95.5,2.74 U$7.1 | HIGH-SIDE_SWITCH_BUTTON_DIVIDER_LOW.P$3 90.17,3.81 90.17,2.16 | 99.69,11.43 92.71,4.45 92.71,3.77 92.71,2.16
  Top 0.61: HIGH-SIDE_BLOCKING_DIODE.A 99.69,12.06 99.69,11.43
GND  (via drill 0.4)
  Top 0.508: U$14.P$17 36.2,36.83 U$14.P$12 31.11,44.45 U$12.2 U$10.2 | MOTOR_LED.C 55.24,57.15 | PROCESSOR_LED.C 73.03,57.15 | 43.87,57.73 43.81,57.65 U$13.1 | PROC_IN_.1UF2.1 76.28,44.45 75.56,44.45 | 47.62,44.45 47.62,44.44 | U$7.3 v96.52,6.35
  Top 0.61: 65.44,24.16 65.41,24.13 65.28,24 RTRIM_PROCESSOR.P$2 65.28,24.1 65.22,24.16 | 50.09,24.13 U$17.GND | MOTOR_TRIM.P$2 47.5,24 47.62,24.13 | MOTOR_MOSFET_PULLDOWN.P$2 52.96,6.39 MOTOR_ENABLE_MOSFET.2 56.22,6.39 56.23,6.38 62.74,6.38 62.82,6.47 | PROCESSOR_ENABLE_MOSFET.2 70.74,6.52 PROCESSOR_MOSFET_PULLDOWN.P$2 63.33,6.47 | 47.6,38.34 47.62,38.36 | 5V_LED.C 90.81,57.15 | RTRIM_5V.P$2 83.19,24.16 | 5V_REGULATOR_PULLDOWN.P$2 81.5,8.04 | 81.5,8.04 81.28,8.26 81.28,24.77 81.92,25.4 83.19,25.4 | 83.69,5.85 BATTERY_VOLTAGE_DIVIDER_LOW.P$3 | 83.69,5.85 v83.19,6.35 81.5,8.04 | HIGH-SIDE_SWITCH_BUTTON_DIVIDER_LOW.P$2 85.72,3.81 83.69,5.85 | U$10.2 36.2,57.7
  Top 0.813: 60.33,57.15 60.33,57.02 60.2,57.15 | PROC10UF2.1 65.81,40.97 65.98,41.27 65.41,41.27 | 65.22,24.16 64.09,24.16 63.33,23.39 63.33,6.47 62.82,6.47 | SERVO_HEADER.1 39.12,3.43 59.78,3.43 62.74,6.38 | HIGH-SIDE_SWITCH.1 101.22,21.96 100.97,22.23 100.97,57.15 | BEEPER.- 45.99,24.13 47.62,24.13 | U$5.P$1 65.48,54.69 65.48,57.23
  Top 1.016: U$9.2 10.47,51.65 JP1.2 JP1.1 3.8,51.49 3.8,47.01
  Top 1.27: 65.44,24.16 DC2DC_PROCESSOR_.GND | 65.41,57.15 65.48,57.23 65.48,54.61 | 65.48,54.69 65.48,48.26 | 65.48,48.26 65.48,45.8 65.41,45.72 65.41,44.42 | 50.09,24.13 47.62,24.13 47.62,33.02 | 65.41,24.13 65.41,33.02 | 65.41,33.02 65.41,37 | 65.41,37 65.41,41.27 65.41,44.42 | 47.62,33.02 47.62,36.83 | 47.62,36.83 47.62,38.36 47.62,40.63 | 47.62,40.63 47.62,44.44 | 43.87,57.73 47.13,57.73 47.16,57.7 | 47.16,57.7 36.2,57.7 16.53,57.7 U$9.2 | 47.62,48.26 47.62,53.34 47.7,53.42 47.7,57.15 47.16,57.7 | 47.62,48.26 47.62,44.44 | MOTOR_IN.1UF1.1 76.34,33.02 75.56,33.02 75.56,36.83 | 75.56,36.83 75.56,40.64 | 75.56,40.64 75.56,44.45 75.56,57.15 | MOTOR_IN.1UF.1 76.34,40.64 75.56,40.64 | MOTOR_IN10UF.1 76.34,36.83 75.56,36.83 | PROC_IN10UF.1 57.79,33.02 57.78,33.02 57.78,36.83 | 57.78,36.83 57.78,40.64 | 57.78,40.64 57.78,45.09 | 57.78,45.09 57.78,57.15 | PROC_IN_.1UF1.1 57.78,40.64 | PROC_IN_.1UF.1 57.78,36.83 | MOTOTR10UF2.1 | MOTOTR10UF2.1 47.62,36.83 | MOTOTR10UF1.1 47.62,40.63 | MOTOTR10UF.1 47.62,44.44 | MOTOR.1UF.1 47.62,33.02 | MOTOTR10UF3.1 47.62,48.26 | PROC10UF3.1 65.52,48.23 65.48,48.26 | PROC10UF1.1 65.58,36.83 65.41,37 | PROC.1UF.1 65.44,32.99 65.41,33.02 | PROC10UF.1 65.41,44.42 | U$4.GND 83.19,24.16 83.19,25.4 83.19,33.02 | 83.19,48.26 U$2.P$1 83.19,57.15 | 83.19,48.26 83.19,44.45 | 83.19,44.45 83.19,40.64 | 83.19,40.64 83.19,36.83 | 83.19,36.83 83.19,33.02 | 5V_IN_CAP_4.1 93.34,32.38 93.34,36.2 | 93.34,36.2 93.34,40.01 | 93.34,40.01 93.34,43.81 | 93.34,43.81 93.34,57.15 | 5V_IN_CAP_3.1 93.34,36.2 | 5V_IN_CAP_2.1 93.34,40.01 | MOTOR_IN.1UF4.1 57.78,45.09 | 5V_IN_CAP_1.1 93.34,43.81 | 5V_OUT_CAP_3.1 83.19,40.64 | 5V_OUT_CAP_2.1 83.19,44.45
  Top 1.27: 5V_OUT_CAP_1.1 83.19,48.26 | 5V_OUT_CAP_4.1 83.19,36.83 | 5V_OUT_CAP_5.1 83.19,33.02 | U$3.1 3.8,47.01
  Top 2.54: 60.2,57.15 65.41,57.15 73.03,57.15 75.56,57.15 83.19,57.15 90.81,57.15 93.34,57.15 100.97,57.15 U$6.P$1 | 60.33,57.15 57.78,57.15 55.24,57.15 47.7,57.15
  Bottom 0.508: v96.52,6.35 v83.19,6.35
IN
  Top 0.508: U$7.2 100.97,6.3 U$1.P$2
MOTORS_ENABLE
  Top 0.61: MOTOR_ENABLE_MOSFET.1 52.96,8.29 MOTOR_MOSFET_PULLDOWN.P$3 52.28,7.71 40.01,7.71 40.01,7.62 U$14.P$23
N$4
  Top 0.508: PROCESSOR_LED.A PROCESSOR_LED_R.P$2
N$5
  Top 0.508: MOTOR_LED_R.P$2 MOTOR_LED.A
N$6
  Top 0.61: PROCESSOR_PULLUP.P$2 79.43,11.74 79.15,11.46 DC2DC_PROCESSOR_.ON/OFF 76.58,11.44 76.58,8.26 75.8,7.47 PROCESSOR_ENABLE_MOSFET.3
N$7
  Top 0.508: U$14.P$20 28.57,38.84 29.84,40.11 29.84,45.72 U$12.3
N$8
  Top 0.61: U$14.P$3 13.34,46.99 U$3.5
N$9
  Top 0.61: MOTOR_PULLUP.P$2 61.59,13.23 61.59,11.68 61.37,11.46 U$17.ON/OFF 58.8,11.44 58.8,8.13 58.01,7.34 MOTOR_ENABLE_MOSFET.3
N$10
  Bottom 0.508: U$9.6 23.5,46.99 U$14.P$7
N$11
  Top 0.508: U$12.4 28.57,46.99 U$14.P$11
N$12
  Top 2.54: U$11.P$2 108.58,48.76 U$6.P$2
N$13
  Bottom 0.61: U$14.P$15 43.81,46.99 U$13.3
N$14
  Bottom 0.61: U$13.2 41.91,50.16 41.91,47.62 U$14.P$14
N$15
  Top 0.508: U$10.4 26.04,50.8 U$14.P$10
N$16
  Top 0.508: U$14.P$21 26.04,38.84 27.3,40.11 27.3,49.53 U$10.3
N$17  (via drill 0.4)
  Top 0.508: BEEPER.+ 33.22,25.4 28.05,25.4 27.3,26.14 v27.3,36.07
  Bottom 0.508: U$14.P$9 27.3,38.1 v27.3,36.07
N$18
  Top 0.508: U$9.5 20.95,46.25 16.62,41.91 U$14.P$6
N$19
  Bottom 0.508: U$9.4 18.41,46.25 14.08,41.91 U$14.P$5
N$20
  Top 0.508: U$9.3 19.68,50.7 19.68,47.73 15.38,43.43 12.83,43.43 11.3,41.91 U$14.P$4
N$21
  Top 0.61: RTRIM_5V.P$3 83.19,19.99 | 83.19,19.99 85.62,19.99 U$4.TRIM | 5V_C_680PF.P$3 83.19,19.99
N$22  (via drill 3.17)
  other vias: 3.81,3.81
N$23  (via drill 3.17)
  other vias: 116.2,57.15
N$24  (via drill 3.17)
  other vias: 3.81,57.15
N$25  (via drill 3.17)
  other vias: 116.2,3.81
N$27
  Bottom 0.508: U$14.P$26 13.34,34.29 6.99,40.64 6.99,45.72
  Bottom 0.61: 6.99,45.72 6.99,46.35 U$3.2
N$28
  Top 0.61: U$14.P$2 10.79,46.99 U$3.4
N$29
  Top 0.61: 5V_LED.A 5V_LED_R1.P$2
N$30  (via drill 0.65)
  Top 0.61: BATTERY_VOLTAGE_DIVIDER_LOW.P$2 92.43,5.85 97.76,11.18 v97.76,11.43 | v97.76,11.43 BATTERY_VOLTAGE_DIVIDER_HIGH.P$3 v97.76,11.43
  Bottom 0.61: U$14.P$27 24.77,12.7 96.49,12.7 v97.76,11.43
N$31
  Top 0.61: U$14.P$1 8.26,46.99 U$3.3
N$32
  Top 0.61: 5V_REGULATOR_PULLDOWN.P$3 89.32,8.04 92.74,11.46 U$4.ON/OFF
N$33
  Top 0.61: 5V_C_680PF.P$2 5V_R_220.P$2
N$34
  Top 0.61: RTRIM_PROCESSOR.P$3 65.28,20.07 | 65.28,20.07 DC2DC_PROCESSOR_.TRIM | PROCESSOR_C_680PF.P$3 65.25,20.04 65.28,20.07
N$35
  Top 0.61: MOTOR_TRIM.P$3 47.5,20.07 | 47.5,20.07 U$17.TRIM | MOTOR_C_680PF.P$3 47.5,20.07
N$36
  Top 0.61: PROCESSOR_R_220.P$2 PROCESSOR_C_680PF.P$2
N$37
  Top 0.61: MOTOR_C_680PF.P$2 MOTOR_R_220.P$2
PROCESSOR_ENABLE  (via drill 0.9)
  Top 0.61: PROCESSOR_ENABLE_MOSFET.1 70.74,8.42 PROCESSOR_MOSFET_PULLDOWN.P$3 v68.71,8.47 68.71,8.51 | U$14.P$24 38.86,6.22 46.6,6.22 v47.83,5
  Bottom 0.61: v47.83,5 65.2,5 68.71,8.51 v68.71,8.47
SERVO_PWM
  Top 0.61: SERVO_HEADER.3 15.88,21.59 U$14.P$25
(copper drawn outside any net)
  shapes: Top area x1

### Text on the board
tPlace: Processor | 5V | Motor controller | Encoders | Serial | Battery | + | + | + | + | R | 5V | GND | Extra | L | Motors | - | 1 | 2 | 3 | 4 | + | Processor | motor | Processor | 5V | low-level controler / 2019 Rev 1.4 | Button | servo
Reference: D5 | D4 | 600 | 1.2K | 470 | A6 | A7 | 6.19K | 13.2K | 16.2K | 680pF | 680pF | 680pF | 220 | 10K | 220 | 10K | 220 | 200K | 10K | 10K | 10K | 47K | 10K